# EAGLE design fm-transmitter v1.1 (EAGLE 7.2.0)
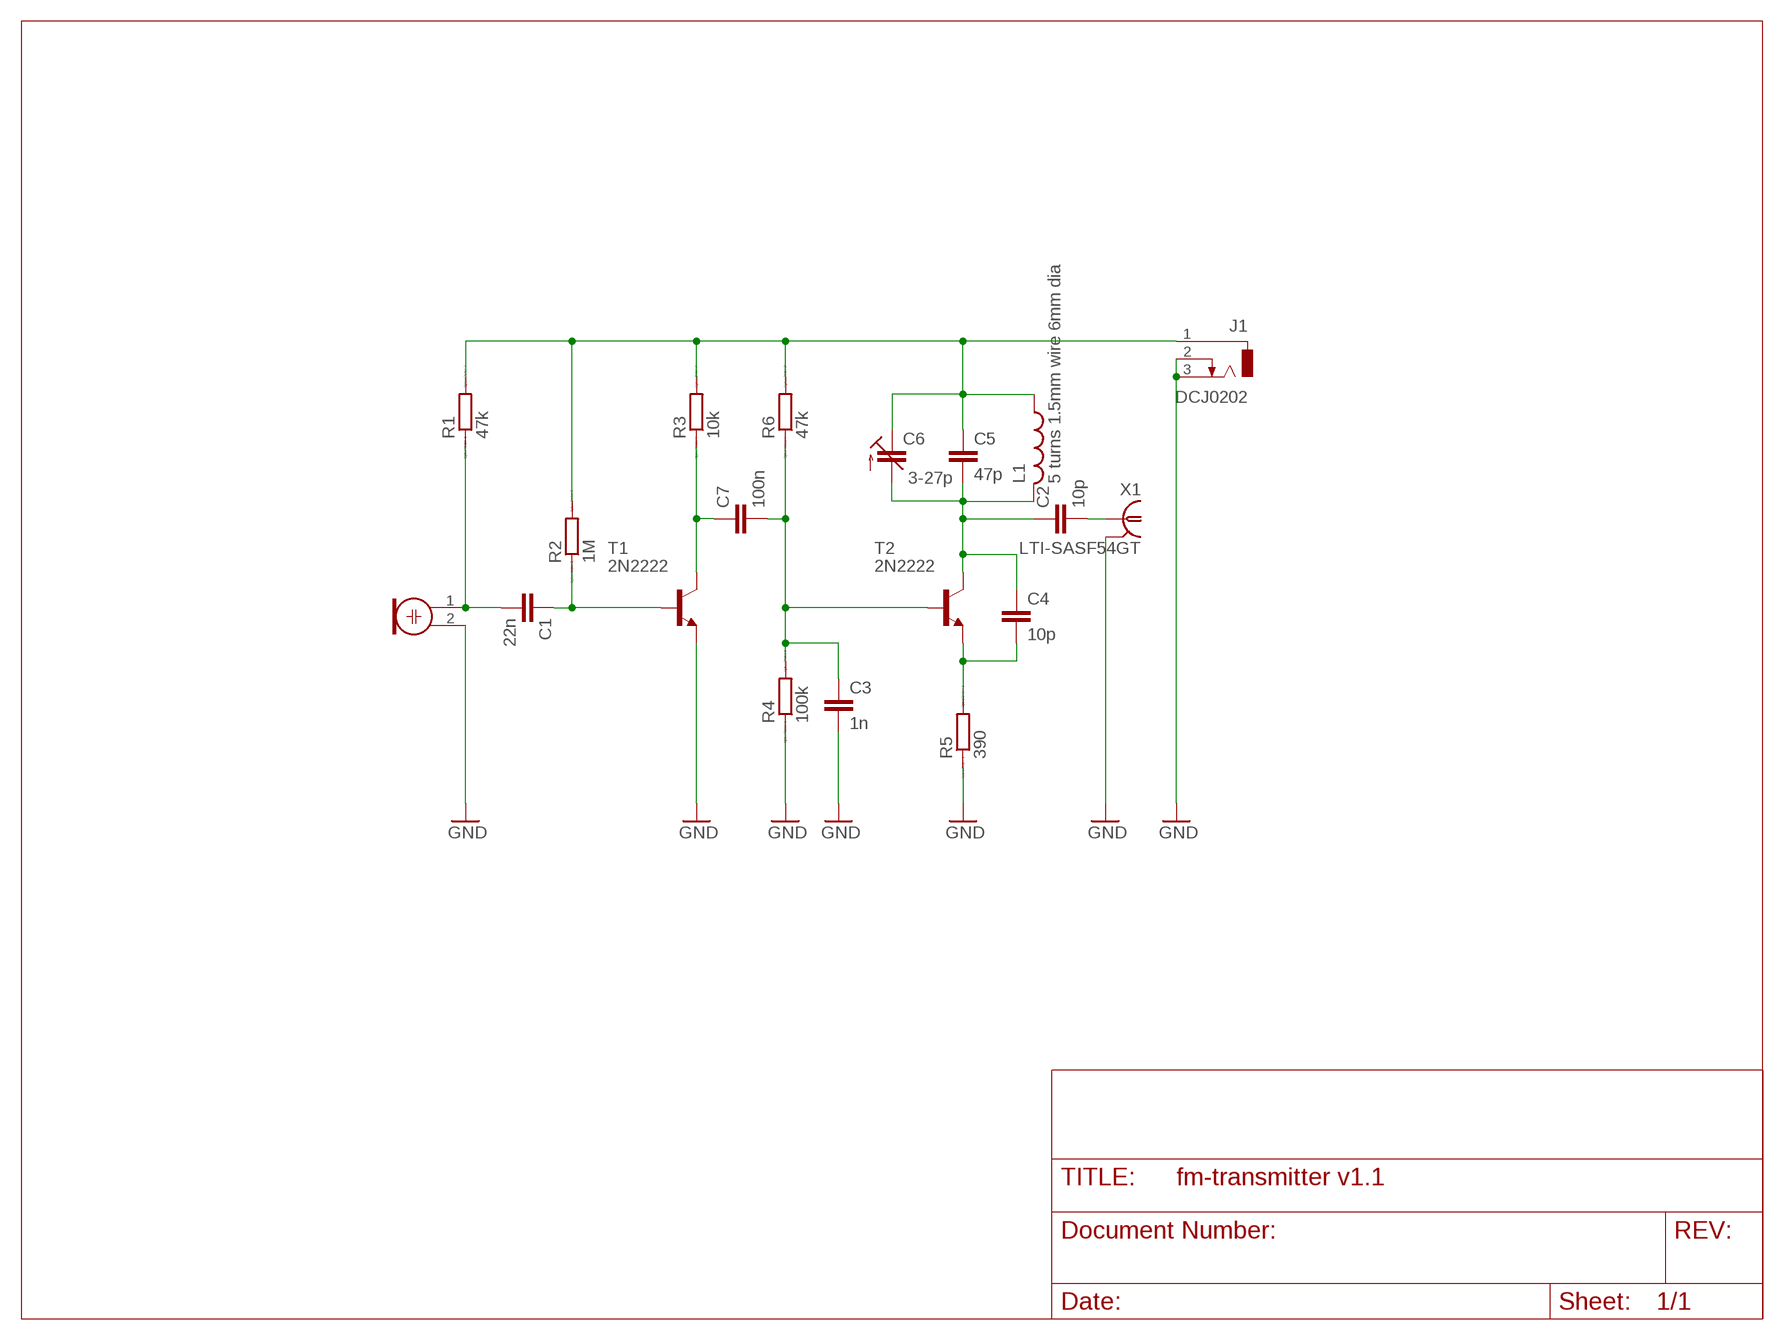
[diagram p0: schematic, sheet 1]

## Parts
C1  22n  C5/2.5  [C5B2.5]
C2  10p  C5/2.5  [C5B2.5]
C3  1n  C5/2.5  [C5B2.5]
C4  10p  C5/2.5  [C5B2.5]
C5  47p  C5/2.5  [C5B2.5]
C6  3-27p  C-TRIMM3050.504  [CTRIM3050.504]
C7  100n  C5/2.5  [C5B2.5]
J1  DCJ0202  [DCJ0202]
L1  5 turns 1.5mm wire 6mm dia  L-US0207/7  [0207/7]
M1  ELECTRET_MICROPHON-F6050AP  [F6050AP]
R1  47k  R0207/10  [0207/10]
R2  1M  R0207/10  [0207/10]
R3  10k  R0207/10  [0207/10]
R4  100k  R0207/10  [0207/10]
R5  390  R0207/10  [0207/10]
R6  47k  R0207/10  [0207/10]
T1  2N2222  [TO18]
T2  2N2222  [TO18]
X1  LTI-SASF54GT  [LTI-SASF54GT]

## Nets
GND: C3.2 J1.2 J1.3 M1.2 R4.1 R5.1 T1.1(E) X1.2 X1.3 X1.4 X1.5
N$1: C1.2 M1.1 R1.1
N$2: C5.1 C6.1(E) J1.1 L1.1 R1.2 R2.2 R3.2 R6.2
N$3: C1.1 R2.1 T1.2(B)
N$4: C7.1 R3.1 T1.3(C)
N$5: C3.1 C7.2 R4.2 R6.1 T2.2(B)
N$6: C2.2 X1.1
N$7: C2.1 C4.1 C5.2 C6.2(A) L1.2 T2.3(C)
N$8: C4.2 R5.2 T2.1(E)

## Library data of the parts
C1-C5 C7 = capacitor-wima:C: CAPACITOR naming: grid - package width
C6 = resistor:C-TRIMM: Trimm capacitor
J1 = con-jack:DCJ0202: DC POWER JACK Source: DCJ0202.pdf; OC_FARNELL: unknown; OC_NEWARK: unknown
L1 = resistor:L-US: INDUCTOR, American symbol; DIAMETER: 6mm; TURNS: 5; WIRE: 1.5mm
M1 = microphon:ELECTRET_MICROPHON-: Electret Condenser Microphone
R1-R6 = eagle-ltspice:R: RESISTOR, European symbol; SPICEMODEL: NONE; SPICEPREFIX: R
T1 T2 = transistor:2N2222: NPN TRANSISTOR
X1 = con-coax:LTI-SASF54GT: SMA vertical PCB thrue hole jack Source: Lighthorse Technologies, inc. SASF54GT.pdf; OC_FARNELL: unknown; OC_NEWARK: unknown

## Board
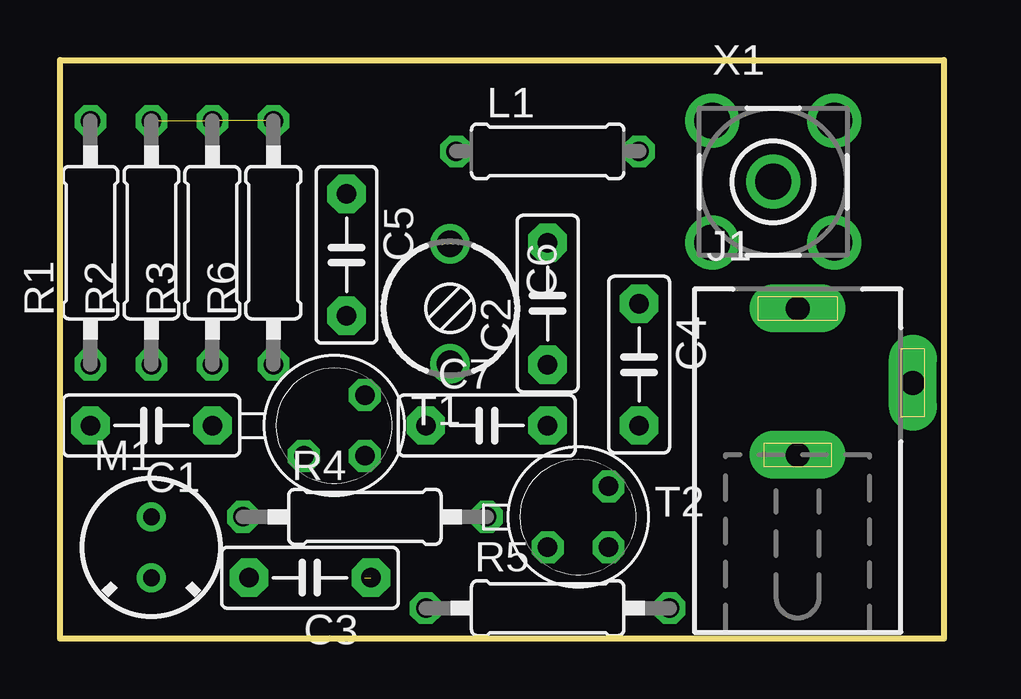
[diagram p1: board, top side]
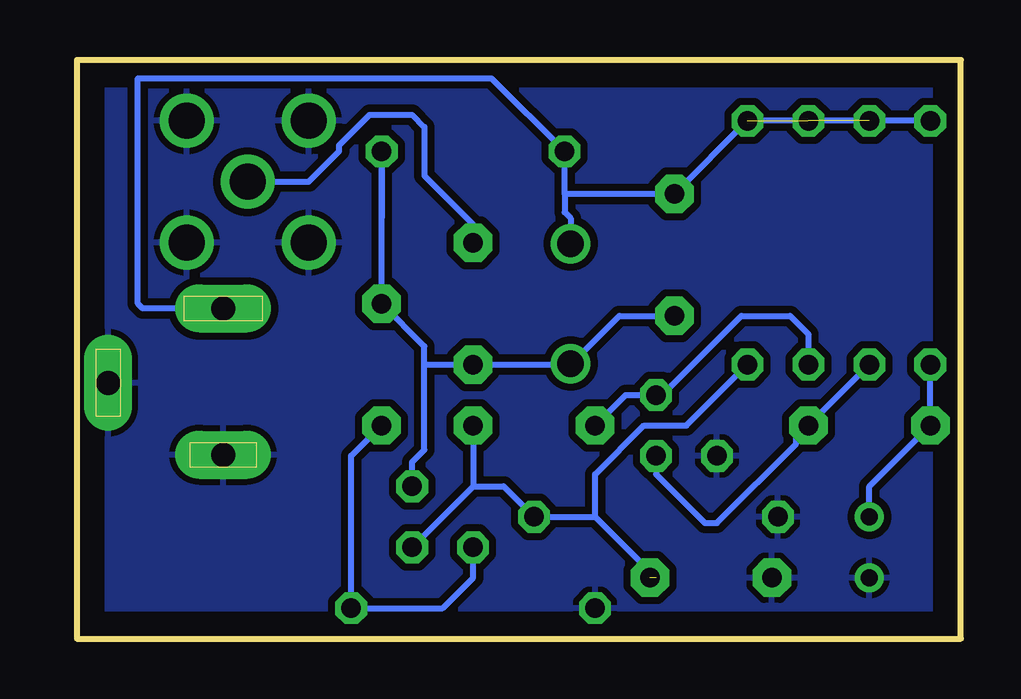
[diagram p2: board, bottom side, seen from below]

Size 36.83 x 24.13 mm. Coordinates in mm from the lower left corner, seen from the top.
Outline: 0,0 0,24.13 36.83,24.13 36.83,0 0,0
Copper layers (1*16): Top 0.035mm / dielectric 1.5mm / Bottom 0.035mm
Design rules "default": minimum track width 10mil, minimum drill 24mil, track to track 8mil, track to pad 8mil, pad to pad 8mil, via to via 8mil, smd to smd 8mil, copper to edge 40mil, drill to drill 8mil, minimum pad ring 10mil, minimum via ring 8mil, stop-mask expansion 4mil, vias tented up to drill 0mil, thermal gap 10mil

### Footprints (pad centres in the part's own frame; a part is rotated, then mirrored left to right if it is on the bottom)
C5B2.5 = drill 0.813 pad 1.6 octagon: 1 -2.54,0; 2 2.54,0
CTRIM3050.504 = drill 1.1: 1 -2.5,0; 2 2.5,0
DCJ0202 = drill 1 pad 2 long: 1 0,3.1; 2 4.8,0; 3 0,-3
0207/7 = drill 0.813 octagon: 1 -3.81,0; 2 3.81,0
F6050AP = drill 0.7 pad 1.2: 1 0,1.27; 2 0,-1.27
0207/10 = drill 0.813 octagon: 1 -5.08,0; 2 5.08,0
TO18 = drill 0.813 octagon: 1 -1.27,-1.27; 2 1.27,-1.27; 3 1.27,1.27
LTI-SASF54GT = drill 1.5 pad 2.2: 1 0,0; 2 -2.54,2.54; 3 2.54,2.54; 4 2.54,-2.54; 5 -2.54,-2.54

### Placement (x,y rotation side)
C1  3.81,8.89 180 top
C2  20.32,13.97 90 top
C3  10.41,2.54 180 top
C4  24.13,11.43 270 top
C5  11.94,16 270 top
C6  16.26,13.97 270 top
C7  17.78,8.89 0 top
J1  30.73,10.67 0 top
L1  20.32,20.32 0 top
M1  3.81,3.81 0 top
R1  1.27,16.51 90 top
R2  3.81,16.51 90 top
R3  6.35,16.51 90 top
R4  12.7,5.08 0 top
R5  20.32,1.27 0 top
R6  8.89,16.51 90 top
T1  11.43,8.89 0 top
T2  21.59,5.08 0 top
X1  29.72,19.05 0 top

### Tracks (layer width: path | path; a pad name or v marks a point on that pad's centre or on a via)
GND
  pour Bottom (isolate 0.305): 0,0 0,22.86 36.83,22.86 36.83,0
N$1
  Bottom 0.254: M1.1 3.81,6.35 C1.2 R1.1
N$2  (2 unrouted)
  Bottom 0.254: R1.2 R6.2 C5.1 16.51,18.54 | 16.51,18.54 L1.1 19.56,23.37 34.29,23.37 34.29,13.97 34.09,13.77 J1.1 | 16.51,18.54 16.51,17.78 16.26,17.53 C6.1
N$3
  Bottom 0.254: R2.1 C1.1 6.86,8.38 6.86,8.13 10.16,4.83 10.67,4.83 12.7,6.86 T1.2
N$4
  Bottom 0.254: C7.1 13.97,10.16 T1.3 12.45,10.16 9.14,13.46 7.11,13.46 6.35,12.7 R3.1
N$5  (1 unrouted)
  Bottom 0.254: T2.2 20.32,6.35 | 20.32,6.35 19.05,6.35 R4.2 15.24,5.08 | 15.24,5.08 12.7,2.54 | C7.2 20.32,6.35 | 15.24,5.08 15.24,6.86 13.21,8.89 11.43,8.89 R6.1
N$6
  Bottom 0.254: X1.1 27.18,19.05 25.91,20.32 25.91,20.57 24.64,21.84 22.86,21.84 22.35,21.34 22.35,19.3 20.32,17.27 C2.2
N$7
  Bottom 0.254: T2.3 22.86,7.37 22.35,7.87 22.35,11.43 | 24.13,17.53 L1.2 C4.1 22.35,12.19 22.35,11.43 | C5.2 14.22,13.46 16.22,11.47 C6.2 16.3,11.43 C2.1 22.35,11.43
N$8
  Bottom 0.254: T2.1 20.32,2.54 21.59,1.27 R5.2 25.4,7.62 C4.2
N$9
  pour Bottom (isolate 0.305): 0,0 0,24.13 35.56,24.13 36.83,24.13 36.83,0